# EAGLE design PCB with nRF SINGLE (EAGLE 6.2)
AUTHOR: K. Townsend
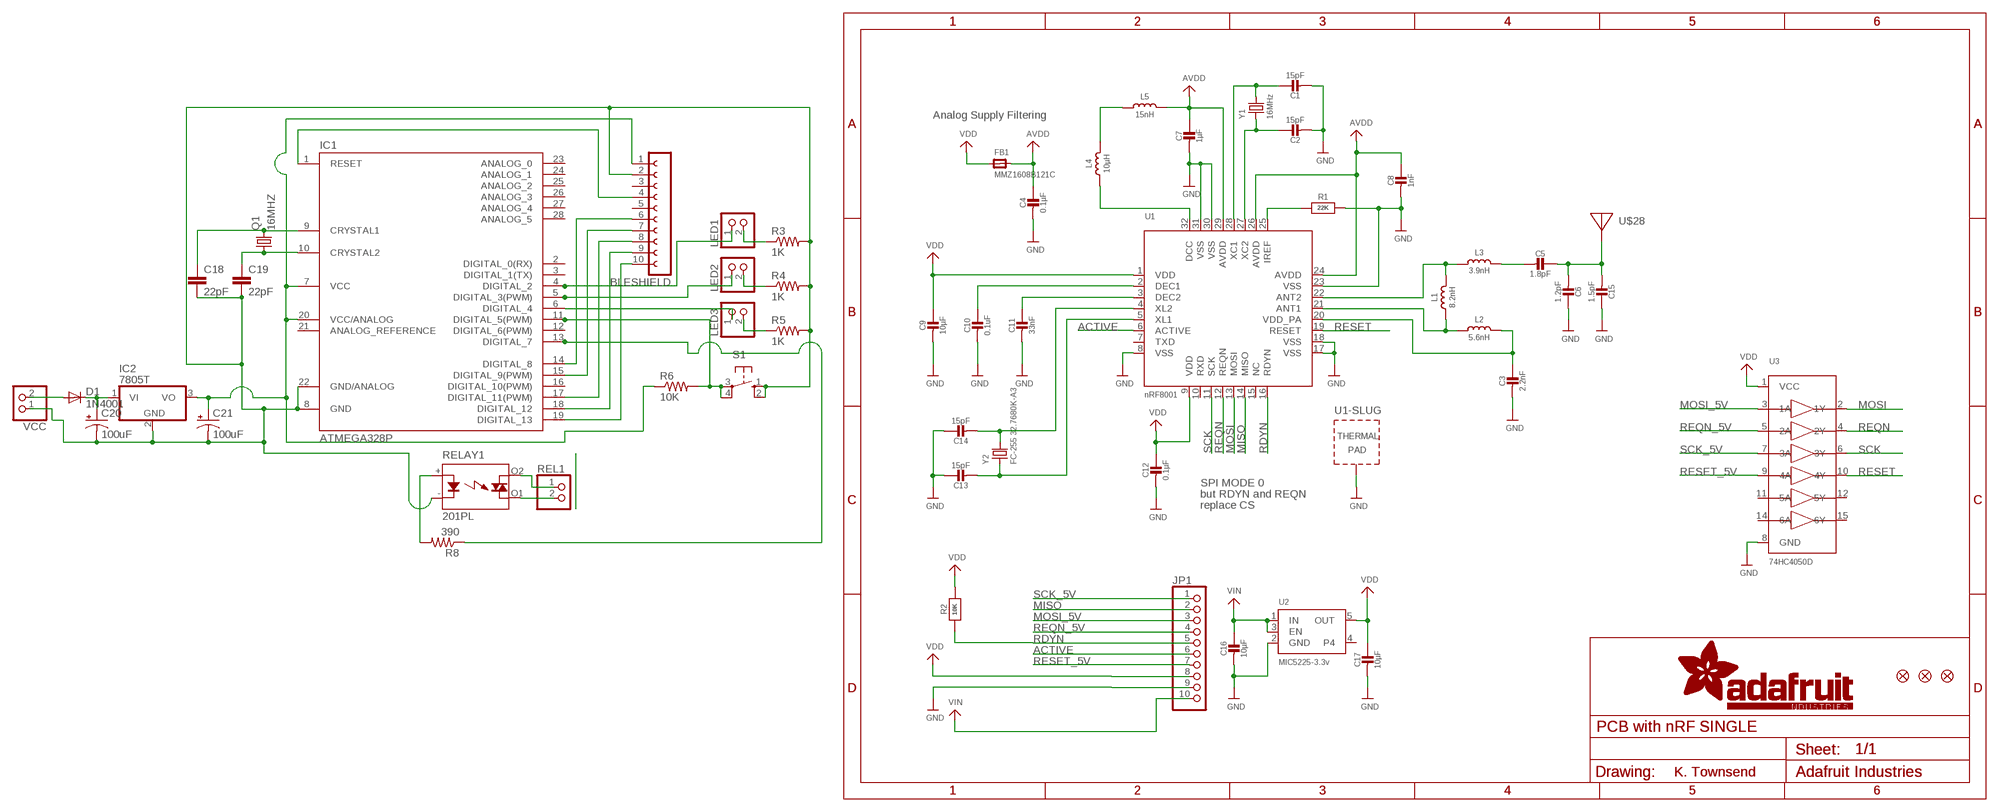
[diagram p0: schematic, sheet 1]

## Parts
BLESHIELD  FE10-1  [FE10]
C1  15pF  CAP_CERAMIC0805-NOOUTLINE  [0805-NO]
C2  15pF  CAP_CERAMIC0805-NOOUTLINE  [0805-NO]
C3  2.2nF  CAP_CERAMIC_0402  [_0402]
C4  0.1µF  CAP_CERAMIC0805-NOOUTLINE  [0805-NO]
C5  1.8pF  CAP_CERAMIC_0402MP  [_0402MP]
C6  1.2pF  CAP_CERAMIC_0402MP  [_0402MP]
C7  1µF  CAP_CERAMIC0805-NOOUTLINE  [0805-NO]
C8  1nF  CAP_CERAMIC_0603  [_0603]
C9  10µF  CAP_CERAMIC0805-NOOUTLINE  [0805-NO]
C10  0.1uF  CAP_CERAMIC0805-NOOUTLINE  [0805-NO]
C11  33nF  CAP_CERAMIC0805-NOOUTLINE  [0805-NO]
C12  0.1µF  CAP_CERAMIC0805-NOOUTLINE  [0805-NO]
C13  15pF  CAP_CERAMIC0805-NOOUTLINE  [0805-NO]
C14  15pF  CAP_CERAMIC0805-NOOUTLINE  [0805-NO]
C15  1.5pF  CAP_CERAMIC_0402MP  [_0402MP]
C16  10µF  CAP_CERAMIC0805-NOOUTLINE  [0805-NO]
C17  10µF  CAP_CERAMIC0805-NOOUTLINE  [0805-NO]
C18  22pF  C-EU025-030X050  [C025-030X050]
C19  22pF  C-EU025-030X050  [C025-030X050]
C20  100uF  CPOL-USE2.5-6  [E2,5-6]
C21  100uF  CPOL-USE2.5-6  [E2,5-6]
D1  1N4001  1N4004  [DO41-10]
FB1  MMZ1608B121C  FERRITE0805  [0805]
FID1  FIDUCIAL""  [FIDUCIAL_1MM]
FID2  FIDUCIAL""  [FIDUCIAL_1MM]
FID3  FIDUCIAL""  [FIDUCIAL_1MM]
IC1  ATMEGA328P  ATMEGA168-PU  [DIL28-3]
IC2  7805T  [TO220H]
JP1  HEADER-1X1070MIL  [1X10_ROUND70]
L1  8.2nH  INDUCTOR_0402  [_0402]
L2  5.6nH  INDUCTOR_0402  [_0402]
L3  3.9nH  INDUCTOR_0402  [_0402]
L4  10µH  INDUCTOR_0603  [_0603]
L5  15nH  INDUCTOR_0603  [_0603]
LED1  PINHD-1X2  [1X02]
LED2  PINHD-1X2  [1X02]
LED3  PINHD-1X2  [1X02]
Q1  16MHZ  CRYSTALHC49S  [HC49/S]
R1  22K  RESISTOR_0805MP  [_0805MP]
R2  10K  RESISTOR0805_NOOUTLINE  [0805-NO]
R3  1K  R-US_0204/5  [0204/5]
R4  1K  R-US_0204/5  [0204/5]
R5  1K  R-US_0204/5  [0204/5]
R6  10K  R-US_0204/5  [0204/5]
R8  390  R-US_0204/5  [0204/5]
REL1  PINHD-1X2  [1X02]
RELAY1  201PL  AQG12105  [AQG]
S1  10-XX  [B3F-10XX]
U1  nRF8001  NRF8001  [QFN32_5MM]
U2  MIC5225-3.3v  VREG_SOT23-5  [SOT23-5]
U3  74HC4050D  74HC4050DTSSOP  [TSSOP16]
U$28  ANTENNA_PCBNRF8001_1.6MM  [ANT_PCB_2.4GHZ_NRF8001_1.6MM_1OZ]
VCC  PINHD-1X2  [1X02]
Y1  16MHz  CRYSTAL2.5X2.0  [CRYSTAL_2.5X2]
Y2  FC-255 32.7680K-A3  CRYSTAL4.9X1.8  [CRYSTAL_4.9X1.8]

## Nets
ACTIVE: JP1.6 U1.6(ACTIVE)
AVDD: C4.1 C7.1 C8.1 FB1.2 L5.2 U1.24(AVDD) U1.26(AVDD) U1.29(AVDD)
GND: C1.2 C2.2 C3.2 C4.2 C6.1 C7.2 C8.2 C9.2 C10.2 C11.2 C12.2 C13.1 C14.1 C15.1 C16.2 C17.2 JP1.9 R1.2 U1.8(VSS) U1.17(VSS) U1.18(VSS) U1.23(VSS) U1.30(VSS) U1.31(VSS) U1.33(TP) U2.2(GND) U3.8(GND)
MISO: JP1.2 U1.14(MISO)
MOSI: U1.13(MOSI) U3.2(1Y)
MOSI_5V: JP1.3 U3.3(1A)
N$1: BLESHIELD.10 IC1.19(DIGITAL_13)
N$2: L1.2 L3.1 U1.22(ANT2)
N$3: L1.1 L2.1 U1.21(ANT1)
N$4: C3.1 L2.2 U1.20(VDD_PA)
N$5: L4.2 L5.1
N$6: C5.2 L3.2
N$7: C11.1 U1.3(DEC2)
N$8: C10.1 U1.2(DEC1)
N$9: C1.1 U1.28(XC1) Y1.3
N$10: C2.1 U1.27(XC2) Y1.1
N$11: L4.1 U1.32(DCC)
N$12: R1.1 U1.25(IREF)
N$13: C5.1 C6.2 C15.2 U$28.FEED
N$14: C18.1 IC1.9(CRYSTAL1) Q1.2
N$15: C19.1 IC1.10(CRYSTAL2) Q1.1
N$16: BLESHIELD.6 IC1.14(DIGITAL_8)
N$17: BLESHIELD.7 IC1.15(DIGITAL_9(PWM))
N$18: BLESHIELD.8 IC1.17(DIGITAL_11(PWM))
N$19: BLESHIELD.9 IC1.18(DIGITAL_12)
N$20: BLESHIELD.1 C21.+ IC1.7(VCC) IC1.20(VCC/ANALOG) IC2.3(VO) R6.1
N$21: BLESHIELD.4 IC1.1(RESET)
N$22: C14.2 U1.4(XL2) Y2.2
N$23: C13.2 U1.5(XL1) Y2.1
N$24: IC1.4(DIGITAL_2) LED1.1
N$25: IC1.5(DIGITAL_3(PWM)) LED2.1
N$26: LED1.2 R3.1
N$27: LED2.2 R4.1
N$28: LED3.2 R5.1
N$29: IC1.11(DIGITAL_5(PWM)) R6.2 S1.3(P) S1.4(P1)
N$32: REL1.2 RELAY1.O1(DS2)
N$33: IC1.13(DIGITAL_7) R8.1
N$34: C20.+ D1.C IC2.1(VI)
N$35: BLESHIELD.2 C18.2 C19.2 C20.- C21.- IC1.8(GND) IC1.22(GND/ANALOG) IC2.2(GND) R3.2 R4.2 R5.2 RELAY1.-(K) S1.1(S) S1.2(S1) VCC.1
N$36: D1.A VCC.2
N$37: IC1.6(DIGITAL_4) LED3.1
N$38: R8.2 RELAY1.+(A)
RDYN: JP1.5 R2.1 U1.16(RDYN)
REL1: REL1.1 RELAY1.O2(DS1)
REQN: U1.12(REQN) U3.4(2Y)
REQN_5V: JP1.4 U3.5(2A)
RESET: U1.19(RESET) U3.10(4Y)
RESET_5V: JP1.7 U3.9(4A)
SCK: U1.11(SCK) U3.6(3Y)
SCK_5V: JP1.1 U3.7(3A)
VDD: C9.1 C12.1 C17.1 FB1.1 JP1.8 R2.2 U1.1(VDD) U1.9(VDD) U2.5(OUT) U3.1(VCC)
VIN: C16.1 JP1.10 U2.1(IN) U2.3(EN)
Unconnected: BLESHIELD.3 BLESHIELD.5 IC1.2(DIGITAL_0(RX)) IC1.3(DIGITAL_1(TX)) IC1.12(DIGITAL_6(PWM)) IC1.16(DIGITAL_10(PWM)) IC1.21(ANALOG_REFERENCE) IC1.23(ANALOG_0) IC1.24(ANALOG_1) IC1.25(ANALOG_2) IC1.26(ANALOG_3) IC1.27(ANALOG_4) IC1.28(ANALOG_5) U1.7(TXD) U1.10(RXD) U1.15(NC) U2.4 U3.11(5A) U3.12(5Y) U3.14(6A) U3.15(6Y)

## Notes on the sheet
- Analog Supply Filtering
- SPI MODE 0
- but RDYN and REQN
- replace CS

## Library data of the parts
BLESHIELD = con-lsta:FE10-1: FEMALE HEADER; OC_FARNELL: unknown; OC_NEWARK: unknown
C1-C17 = microbuilder:CAP_CERAMIC: Ceramic Capacitors For new designs, use the packages preceded by an '_' character since they are more reliable: The following footprints should be used on most boards: _0402 - Standard footprint for regular board layouts _0603 - Standard footprint for regular board layouts _0805 - Standard footprint for regular board layouts _1206 - Standard footprint for regular board layouts For extremely tight-pitch boards where space is at a premium, the following 'micro-pitch' footprints can be used (smaller pads, no silkscreen outline, etc.): _0402MP - Micro-pitch footprint for very dense/compact boards _0603MP - Micro-pitch footprint for very dense/compact boards _0805MP - Micro-pitch footprint for very dense/compact boards _1206MP - Micro-pitch footprint for very dense/compact boards
C18 C19 = rcl:C-EU: CAPACITOR, European symbol
C20 C21 = rcl:CPOL-US: POLARIZED CAPACITOR, American symbol
D1 = diode:1N4004: DIODE general purpose rectifier, 1 A
FB1 = microbuilder:FERRITE: Ferrite Bead 0603 MMZ1608B121C - 120 Ohm @ 100MHz, 600mA, 0.15 Ohm DC Resistance - Digikey: 445-2164-1-ND BK1608HW121-T - 120 Ohm, 600mA Ferrite Chip - Digikey: 587-1876-2-ND 0805 HZ0805B272R-10 - 2.7K Ohm @ 100MHz, 200mA, 0.8 Ohm DC Resistance - Digikey: 240-2504-1-ND (see also Murata BLM21BD272SN1L) MMZ2012Y152B - 1.5K Ohm @ 100MHz, 500mA, 0.4 Ohm DC Resistance - Digikey: 445-1560-1-ND - Mainly for high frequency (80-400MHz) MMZ2012R102A - 1K Ohm @ 100MHz, 500mA, 0.3 Ohm DC Resistance - Digikey: 445-1555-2-ND - More general purpose (10-200MHz)
FID1-FID3 = microbuilder:FIDUCIAL: Fiducial Alignment Points Various fiducial points for machine vision alignment.; BOM: EXCLUDE
IC1 = Arduino-AVR:ATMEGA168-PU
IC2 = linear:78*: Positive VOLTAGE REGULATOR Source: http://cache.national.com/ds/LM/LM78L05.pdf http://www.fairchildsemi.com/ds/LM/LM7805.pdf
JP1 = microbuilder:HEADER-1X10: PIN HEADER
L1-L5 = microbuilder:INDUCTOR: Inductors 0603: 10nH Ceramic Inductor - microwire antenna/RF (Digikey: 712-1434-2-ND) 0805: 560nH Ceramic Inductor - RF (Digikey: 553-1047-1-ND) 270nH Ceramic Inductor - Q = 40@250MHz, +-5%, 1 Ohm DC Resistance (Digikey: 535-10506-2-ND) 1007 (2518 Metric) SMT: 10µH 10% 250mOhm 820mA 1007 Inductor (Digikey: 587-2189-1-ND) 22µH 10% 500mOhm 580mA 1007 Inductor (Digikey: 587-2190-1-ND) 47µH 10% 950mOhm 420mA 1007 Inductor (Digikey: 587-2191-1-ND) 47µH 5% 100mOhm 1A 1008 Inductor (Digikey: 732-1816-1-ND) 5.0x5.0mm (Taiyo Yuden NR5040 Series) 6.8µH 20% 2.3A 64mOhm Inductor (Digikey: 587-2374-2-ND) 5.0x5.0mm (TDK VLC5045 Series) 4.7µH 20% 3.3A 34mOhm Inductor (Digikey: 445-6526-1-ND) 6.8µH 20% 2.7A 46mOhm Inductor (Digikey: 445-6527-1-ND) 6.0x6.0mm (TDK VLC6045 Series) 4.7µH 20% 3.8A 27mOhm Inductor (Digikey: 445-6538-2-ND) 6.8µH 20% 3A 41mOhm Inductor (Digikey: 445-6540-1-ND) 6.2µH 30% 2.2A 45mOhm Inductor (Digikey: SRR5028-6R2YCT-ND) - Not TDK VLC6045 but footprint should match 6.0x6.0mm (TDK SLF6045 Series) 6.8uH 30% 2A 33mOhm Inductor (Digikey: 445-4572-1-ND, Mouser: 810-SLF645T6R8N2R0PF) 6.0x6.0mm (Sumida CDRH5D28 Series) 6.2uH 30% 1.8A 45mOhm Inductor (Digikey: 308-1542-1-ND) Taiyo Yuden NR3015T2R2M - 2.2uH 20% 1.5A (Digikey: 587-1648-2-ND, Mouser: 963-NR3015T2R2M) - Used with TI TPS62172 CoilCraft RFID Transponder Coil - MA5532-AE (For use with AS3935 Lightning Sensor)
LED1-LED3 REL1 VCC = pinhead:PINHD-1X2: PIN HEADER
Q1 = crystal:CRYSTAL: CRYSTAL; OC_FARNELL: 1667008; OC_NEWARK: unknown
R1 R2 = microbuilder:RESISTOR: Resistors For new designs, use the packages preceded by an '_' character since they are more reliable: The following footprints should be used on most boards: _0402 - Standard footprint for regular board layouts _0603 - Standard footprint for regular board layouts _0805 - Standard footprint for regular board layouts _1206 - Standard footprint for regular board layouts For extremely tight-pitch boards where space is at a premium, the following 'micro-pitch' footprints can be used (smaller pads, no silkscreen outline, etc.): _0402MP - Micro-pitch footprint for very dense/compact boards _0603MP - Micro-pitch footprint for very dense/compact boards _0805MP - Micro-pitch footprint for very dense/compact boards _1206MP - Micro-pitch footprint for very dense/compact boards
R3-R6 R8 = resistor:R-US_: RESISTOR, American symbol
RELAY1 = relay:AQG*: SOLID STATE RELAY NAiS Zero-cross, Non zero-cross Source: http://www.mew-europe.com/.. en_ds_61611_0000.pdf; MF: AROMAT/ MATSUSHITA; MPN: AQG12105; OC_FARNELL: unknown; OC_NEWARK: 20J4759
S1 = switch-omron:10-XX: OMRON SWITCH; MPN: B3F-1000; OC_FARNELL: 176432; OC_NEWARK: 36M3542
U1 = microbuilder:NRF8001: nRF8001 - Bluetooth Low-Energy Transceiver VDD: 1.9-3.6V Temp: -40°C - 85°C
U2 = microbuilder:VREG_SOT23-5: SOT23-5 Fixed Voltage Regulators Part Current Out V Out V In V Dropout θJA (°C/W) TJ (°C) Digikey Part No. ADP121 150mA 3.3V 3.4-5.5V 0.09V @ 150mA -- -- ADP121-AUJZ33R7CT-ND ADP121 150mA 3.0V 3.1-5.5V 0.09V @ 150mA -- -- ADP121-AUJZ30R7CT-ND ADP122 300mA 3.3V 3.4-5.5V 0.085V @ 300mA -- -- ADP122AUJZ-3.3-R7CT-ND ADP1712 300mA 3.3V 3.5-5.5V 0.17V @ 300mA -- -- ADP1712AUJZ-3.3-R7TR-ND AP7311 (Low Cost) 150mA 3.3V 3.5-6V 0.15V @ 150mA -- -- AP7311-33WG-7DICT-ND LD39015M18R 150mA 1.8V 1.9V-5.5V 0.08V @ 100mA -- -- 497-6977-1-ND LP2985A-33DBVR 150mA 3.3V 3.3-16V 0.28V @ 150mA 206 150 296-18479-1-ND MCP1824T-3302E/OT 300mA 3.3V 3.5V-6V 0.2V @ 300mA -- -- MCP1824T-3302E/OTCT-ND MIC5205-2.5YM5 TR 150mA 2.5V 2.7-16V 0.165V @ 150mA -- -- 576-1257-2-ND MIC5205-3.0YM5 TR 150mA 3.0V 3.2V-16V 0.165V @ 150mA -- -- 576-1258-2-ND MIC5205-3.3YM5 TR 150mA 3.3V 3.5V-16V 0.165V @ 150mA -- -- 576-1259-2-ND TPS780330220 150mA 3.3V+2.2V 3.6-5.5V 250mV Max -- -- 296-23332-1-ND TDA3663/N1,135 100mA 3.3V 3.5-45V 0.18V @ 50mA -- -- 568-5343-1-ND Max operating temp can be calculated using θJA, TJ (max junction temperature), and power in watts. Set the "Maximum Ambient Temperature" until it reaches TJ ("Max Junction Temperature"), which is the absolute limit for safe use of the regulator: Heat Sink Temperature Calculator <http://www.daycounter.com/Calculators/Heat-Sink-Temperature-Calculator.phtml> For example, With 12V source into a 3.3V LP2985 and a 30mA load, we are dissipating (12V-3.3V) * 0.03A = 0.261W. With a θJA of 206 °C/W, a TJ of 150°C, and 261mW we can safely use the chip without a heat sink up to 75°C (=147.1°C Junction Temperature).
U3 = microbuilder:74HC4050D: 6-channel level shifter 74HC4050D - 2V-6V Supply SOIC16 Digikey: 74HC4050D,653-ND Mouser: 771-74HC4050D-T TSSOP16 Digikey: 296-9215-1-ND Mouser:
U$28 = microbuilder:ANTENNA_PCB: Various pre-calculated PCB Antennas NRF8001 1.6mm 1Oz - 2.4GHz PCB antenna for 1.6mm PCBs with 1oz copper, double-sided boards (no GND plan beneath antenna). See nRF2740 production files for further information and impedance matching network. 868MHz/2.4GHz DUALBAND - Dual 868MHz and 2.4GHz centered antenna based on board #6 of the CC-ANTENNA-DK from Chipcon/TI
Y1 Y2 = microbuilder:CRYSTAL: Crystals HC49UP - Surface Mount Crystal 4.0MHz 18pF +/-30ppm Surface Mount Crystal [Digikey: 535-9857-1-ND] 12.0 MHz Surface Mount Crystal [Digikey: 535-9869-6-ND] 25.0 MHz Surface Mount Crystal [Digikey: 535-9078-1-ND] 2.5 x 2.0mm - MEMs SMT Crystal 16.0 MHz 10pF 20ppm 2.5 x 2.0mm Crystal [Digikey -40-85°C: 535-10923-1-ND] 3.2 x 2.5mm - MEMs SMT Crystal 12.0 MHz 8pF 15ppm 3.2 x 2.5mm Crystal [Digikey: -10-70°C: 644-1047-1-ND -40-125°C: 644-1128-1-ND] 40~85°C cheaper: 644-1173-6-ND 16.0 MHz 8pF 15ppm 3.2 x 2.5mm Crystal [Digikey: -10-70°C: 644-1049-1-ND -40-125°C: 644-1129-2-ND]-40~85°C cheaper: 644-1175-6-ND 16.0 MHz 10pF 10ppm 3.2 x 2.5mm Crystal [Digikey: 644-1100-1-ND] 27.12 MHz 18pF 30ppm 3.2 x 2.5mm Crystal [Digikey: 887-1424-1-ND] 27.12MHz 10pF 10ppm 3.2 x 2.5mm Crystal [Digikey: 887-1329-1-ND] 4.9 x 1.8mm - MEMs SMT Crystal 32.768 KHz 12.5pF 20ppm 4.9 x 1.8mm Crystal [Digikey: SE2415CT-ND] 8.0 x 3.8mm - Surface Mount Crystal 32.768kHz 12.5pF 20ppm -40°C-85°C [Digikey: 535-9166-2-ND] Cylinder 32.768KHz Cylinder Crystal (2x6mm body) [Ex. Digikey: 300-8341-2-ND]

## Board
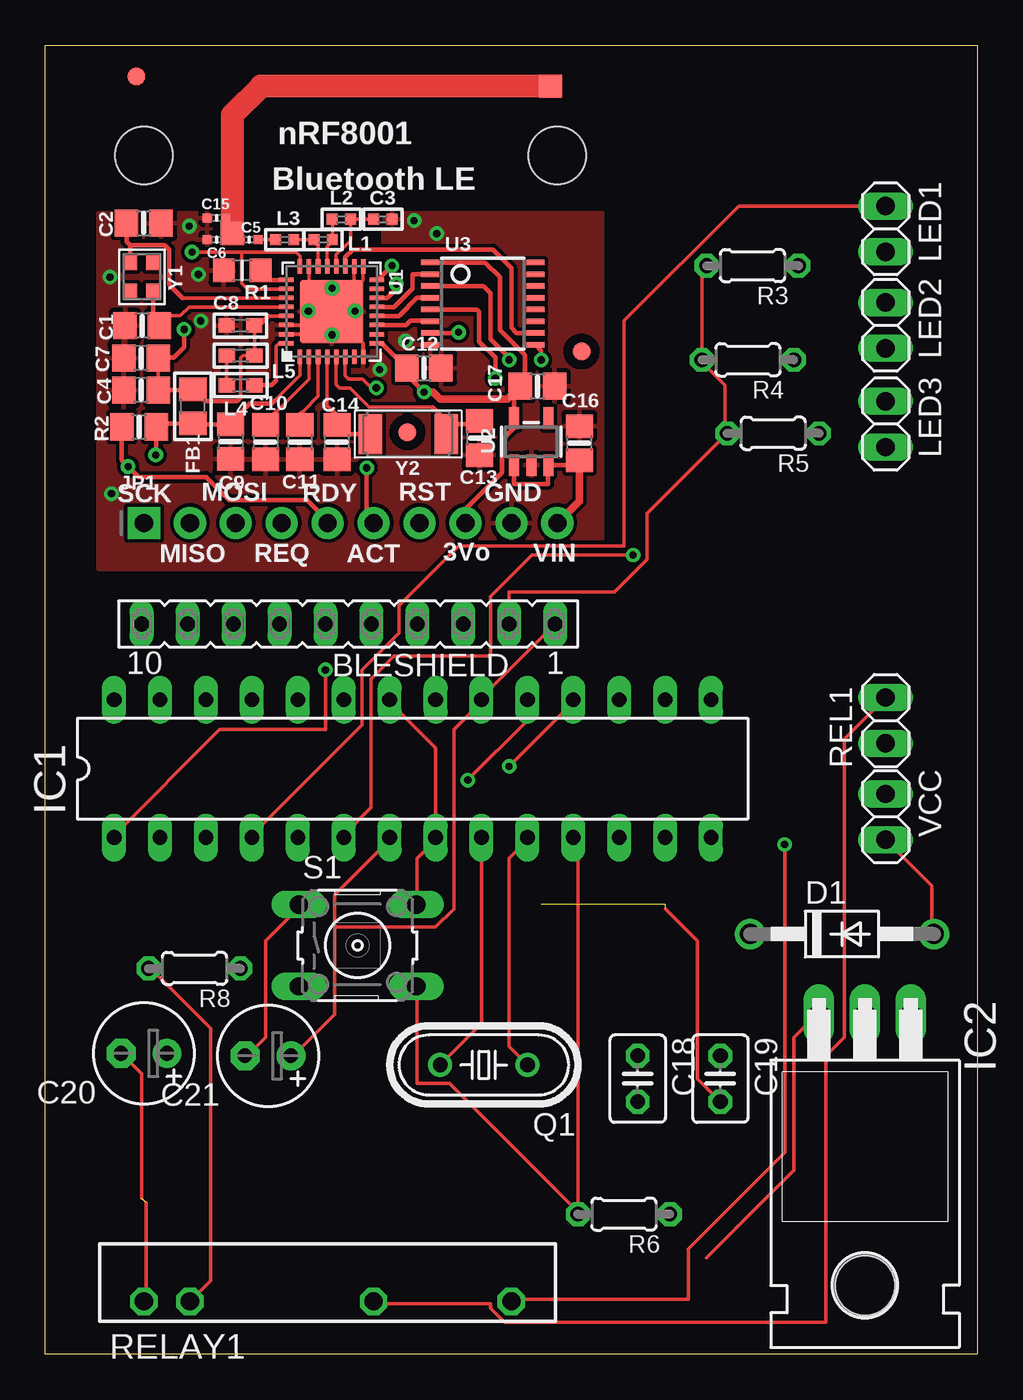
[diagram p1: board, top side]
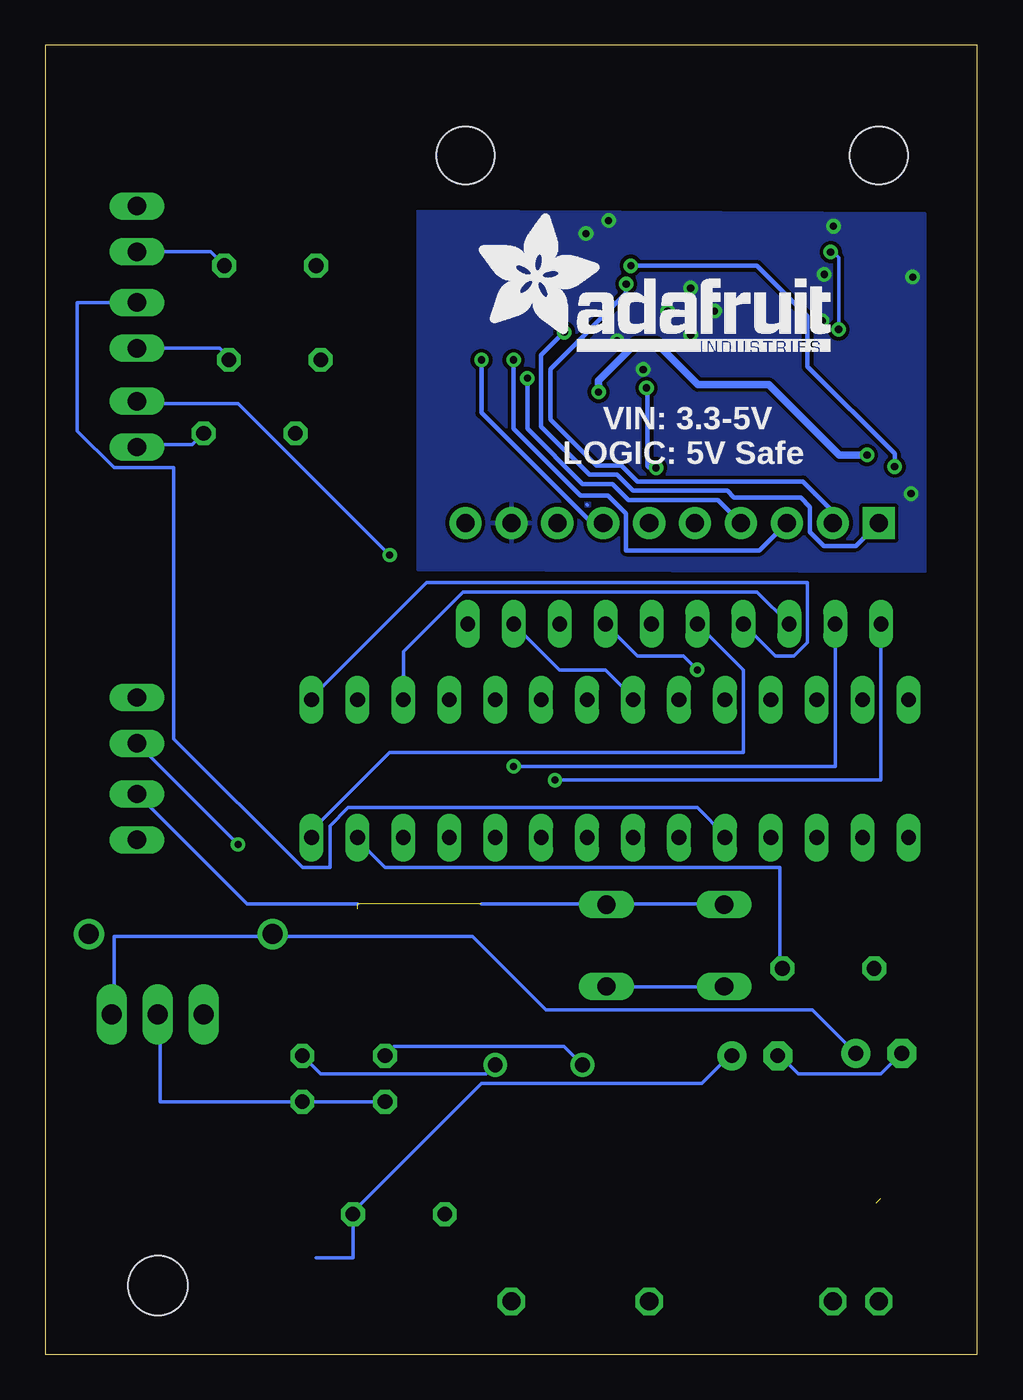
[diagram p2: board, bottom side, seen from below]

Size 51.56 x 72.39 mm. Coordinates in mm from the lower left corner, seen from the top.
Outline: 0,0 0,72.39 51.56,72.39 51.56,0 0,0
Copper layers (1*16): Top 0.035mm / dielectric 1.5mm / Bottom 0.035mm
Design rules: minimum track width 8mil, minimum drill 15.5mil, track to track 8mil, track to pad 8mil, pad to pad 8mil, via to via 8mil, smd to smd 8mil, copper to edge 10mil, drill to drill 8mil, minimum pad ring 10mil, minimum via ring 8mil, stop-mask expansion 4mil, vias tented up to drill 20mil, thermal gap 10mil
Holes 3.2 mm at 5.46,66.29 28.32,66.29
tRestrict: area 13.2,56.6 to 13.5,56.7

### Footprints (pad centres in the part's own frame; a part is rotated, then mirrored left to right if it is on the bottom)
FE10 = drill 0.813 long: 1 -11.43,0; 2 -8.89,0; 3 -6.35,0; 4 -3.81,0; 5 -1.27,0; 6 1.27,0; 7 3.81,0; 8 6.35,0; 9 8.89,0; 10 11.43,0
0805-NO = smd 1.3 x 1.5: 1 -0.95,0; 2 0.95,0
_0402 = smd 0.6 x 0.6: 1 -0.508,0; 2 0.508,0
_0402MP = smd 0.5 x 0.5: 1 -0.508,0; 2 0.508,0
_0603 = smd 0.9 x 0.8: 1 -0.762,0; 2 0.762,0
C025-030X050 = drill 0.813 octagon: 1 -1.27,0; 2 1.27,0
E2,5-6 = drill 0.813 pad 1.6: + -1.27,0 | drill 0.813 pad 1.6 octagon: - 1.27,0
DO41-10 = drill 1.118: A 5.08,0; C -5.08,0
0805 = smd 1.3 x 1.5: 1 -0.95,0; 2 0.95,0
FIDUCIAL_1MM = smd 1 x 1: 1 0,0
DIL28-3 = drill 0.813 long: 1 -16.51,-3.81; 2 -13.97,-3.81; 3 -11.43,-3.81; 4 -8.89,-3.81; 5 -6.35,-3.81; 6 -3.81,-3.81; 7 -1.27,-3.81; 8 1.27,-3.81; 9 3.81,-3.81; 10 6.35,-3.81; 11 8.89,-3.81; 12 11.43,-3.81; 13 13.97,-3.81; 14 16.51,-3.81; 15 16.51,3.81; 16 13.97,3.81; 17 11.43,3.81; 18 8.89,3.81; 19 6.35,3.81; 20 3.81,3.81; 21 1.27,3.81; 22 -1.27,3.81; 23 -3.81,3.81; 24 -6.35,3.81; 25 -8.89,3.81; 26 -11.43,3.81; 27 -13.97,3.81; 28 -16.51,3.81
TO220H = drill 1.118 long: 1 -2.54,-10.16; 2 0,-10.16; 3 2.54,-10.16 | hole 3.302: 0,4.826
1X10_ROUND70 = drill 1 pad 1.778 square: 1 -11.43,0 | drill 1 pad 1.778: 2 -8.89,0; 3 -6.35,0; 4 -3.81,0; 5 -1.27,0; 6 1.27,0; 7 3.81,0; 8 6.35,0; 9 8.89,0; 10 11.43,0
1X02 = drill 1.016 long: 1 -1.27,0; 2 1.27,0
HC49/S = drill 0.813: 1 -2.413,0; 2 2.413,0
_0805MP = smd 1.2 x 1.3: 1 -1.016,0; 2 1.016,0
0204/5 = drill 0.813 octagon: 1 -2.54,0; 2 2.54,0
AQG = drill 1 octagon: + -7.62,0; - -10.16,0; O1 2.54,0; O2 10.16,0
B3F-10XX = drill 1.016 long: 1 -3.251,2.261; 2 3.251,2.261; 3 -3.251,-2.261; 4 3.251,-2.261
QFN32_5MM = smd 0.8 x 0.25: 1 -2.5,1.75; 2 -2.5,1.25; 3 -2.5,0.75; 4 -2.5,0.25; 5 -2.5,-0.25; 6 -2.5,-0.75; 7 -2.5,-1.25; 8 -2.5,-1.75; 17 2.5,-1.75; 18 2.5,-1.25; 19 2.5,-0.75; 20 2.5,-0.25; 21 2.5,0.25; 22 2.5,0.75; 23 2.5,1.25; 24 2.5,1.75 | smd 0.25 x 0.8: 9 -1.75,-2.5; 10 -1.25,-2.5; 11 -0.75,-2.5; 12 -0.25,-2.5; 13 0.25,-2.5; 14 0.75,-2.5; 15 1.25,-2.5; 16 1.75,-2.5; 25 1.75,2.5; 26 1.25,2.5; 27 0.75,2.5; 28 0.25,2.5; 29 -0.25,2.5; 30 -0.75,2.5; 31 -1.25,2.5; 32 -1.75,2.5 | smd 3.5 x 3.5: 33 0,0
SOT23-5 = smd 0.55 x 1.2: 1 -0.95,-1.3; 2 0,-1.3; 3 0.95,-1.3; 4 0.95,1.3; 5 -0.95,1.3
TSSOP16 = smd 0.305 x 0.991: 1 -2.275,-2.918; 2 -1.625,-2.918; 3 -0.975,-2.918; 4 -0.325,-2.918; 5 0.325,-2.918; 6 0.975,-2.918; 7 1.625,-2.918; 8 2.275,-2.918; 9 2.275,2.918; 10 1.625,2.918; 11 0.975,2.918; 12 0.325,2.918; 13 -0.325,2.918; 14 -0.975,2.918; 15 -1.625,2.918; 16 -2.275,2.918
ANT_PCB_2.4GHZ_NRF8001_1.6MM_1OZ = smd 1.27 x 1.27: FEED 0,0; TESTPOINT -8.169,17.605
CRYSTAL_2.5X2 = smd 0.9 x 0.75: 1 -0.825,-0.625; 2 0.825,-0.625; 3 0.825,0.625; 4 -0.825,0.625
CRYSTAL_4.9X1.8 = smd 1.3 x 2.2: 1 -2.1,0; 2 2.1,0

### Placement (x,y rotation side)
BLESHIELD  16.76,40.39 180 top
C1  5.37,56.87 180 top
C2  5.45,62.56 0 top
C3  18.67,62.76 0 top
C4  5.3,53.32 180 top
C5  11.27,61.64 0 top
C6  9.47,61.64 0 top
C7  5.3,55.09 180 top
C8  10.8,56.89 180 top
C9  10.25,50.46 270 top
C10  12.18,50.43 270 top
C11  14.08,50.43 270 top
C12  20.94,54.53 0 top
C13  24.03,50.67 90 top
C14  16.13,50.44 90 top
C15  9.47,62.84 0 top
C16  29.54,50.38 90 top
C17  27.22,53.53 0 top
C18  32.77,15.24 270 top
C19  37.34,15.24 270 top
C20  5.46,16.64 180 top
C21  12.32,16.51 180 top
D1  44.07,23.24 0 top
FB1  8.17,52.42 90 top
FID1  20.03,50.99 270 top
FID2  29.66,55.45 270 top
FID3  5.05,70.67 270 top
IC1  20.32,32.38 0 top
IC2  45.34,8.64 180 top
JP1  16.89,45.97 0 top
L1  15.37,61.64 180 top
L2  16.37,62.76 0 top
L3  13.25,61.64 180 top
L4  10.81,53.58 180 top
L5  10.81,55.23 0 top
LED1  46.48,62.23 270 top
LED2  46.48,56.9 270 top
LED3  46.48,51.44 270 top
Q1  24.26,16 180 top
R1  10.9,59.93 180 top
R2  5.19,51.29 0 top
R3  39.12,60.2 180 top
R4  38.86,54.99 180 top
R5  40.26,50.93 180 top
R6  32,7.75 180 top
R8  8.26,21.34 180 top
REL1  46.48,35.05 90 top
RELAY1  15.62,2.92 0 top
S1  17.27,22.61 0 top
U1  15.84,57.66 90 top
U2  26.89,50.47 0 top
U3  24.19,58.1 270 top
U$22  [ADAFRUIT_TEXT_20MM]  27.72,55.45 0 bottom
U$28  10.35,61.96 270 top
VCC  46.48,29.72 270 top
Y1  5.35,59.59 270 top
Y2  20.07,50.88 180 top

### Tracks (layer width: path | path; a pad name or v marks a point on that pad's centre or on a via)
ACTIVE  (via drill 0.39, 0.4)
  Top 0.203: U1.6 16.59,54.12 16.77,53.94 17.55,53.94 18.05,53.44 v18.31,53.44
  Top 0.254: JP1.6 17.78,46.35 v17.78,49.02
  Bottom 0.203: v18.31,53.44 18.26,53.44
  Bottom 0.254: 18.26,53.44 18.26,49.12 18.16,49.02 v17.78,49.02
AVDD  (via drill 0.4)
  Top 0.203: U1.24 14.09,60.72 13.87,60.94 10.87,60.94 | 10.87,60.94 8.14,60.94 v8.12,60.95 | U1.26 11.2,58.91 10.87,59.24 10.87,60.94 | U1.29 12.34,57.41 | C7.1 C4.1 | C8.1 11.57,56.88 L5.2 10.92,55.23 10.8,55.11 10.8,52.9
  Top 0.254: C4.1 8.17,53.31 FB1.2 8.84,52.7 10.61,52.7 10.8,52.9 | 12.34,57.41 11.81,56.89 C8.1 | v7.68,56.67 7.68,55.69 7.11,55.12 6.29,55.12 C7.1
  Bottom 0.203: v7.68,56.67 7.68,60.64 7.98,60.94 8.11,60.94 v8.12,60.95
GND  (via drill 0.4)
  Top 0.203: U1.33 15.09,56.91 14.47,56.91 | U1.8 17.59,55.91 U1.33 | U1.17 17.59,59.41 U1.33 | U1.23 14.59,59.22 14.67,59.14 15.69,59.14 v15.87,58.96 | U1.18 17.09,57.73 v17.14,57.69 | U1.30 14.47,56.91 | U1.31 14.4,56.41 14.47,56.34 14.47,56.91
  other vias: 15.87,56.37 14.55,57.69 18.5,54.45 21.66,61.97 20.41,62.69 8.6,57.14 8.47,59.71 19.93,56.04 3.67,47.59 3.59,59.57 7.97,62.38
  pour Bottom: 2.92,63.07 30.94,63.2 30.94,43.41 2.92,43.28
  pour Top: 18.67,59.14 18.67,63.14 30.81,63.14 30.81,43.41 2.92,43.41 2.92,63.14 9.17,63.14 9.17,60.64 13.17,60.64 13.17,59.14
MISO  (via drill 0.39)
  Top 0.254: U1.14 18.91,58.41 19.43,58.93 v19.43,59.18
  Bottom 0.254: JP1.2 8,46.61 9.65,48.26 18.8,48.26 19.68,49.15 21.08,49.15 23.62,51.69 23.62,54.48 19.43,58.67 v19.43,59.18
MOSI
  Top 0.254: U3.2 20.36,59.73 20.32,59.69 20.32,58.93 19.3,57.91 U1.13
MOSI_5V  (via drill 0.39)
  Top 0.254: U3.3 24.23,59.08 24.64,58.67 24.64,56.13 25.65,55.12 v25.65,54.99
  Bottom 0.254: v25.65,54.99 25.65,51.18 21.97,47.5 20.45,47.5 19.43,46.48 19.43,44.45 12.06,44.45 JP1.3
N$1  (via drill 0.39)
  Top 0.203: v23.37,31.75 26.67,35.05 IC1.19
  Bottom 0.203: BLESHIELD.10 5.33,31.75 v23.37,31.75
N$2
  Top 0.203: U1.22 15.09,61.31 14.87,61.54 L1.2 L3.1
N$3
  Top 0.203: U1.21 15.59,61.25 15.88,61.54 L1.1 15.88,62.75 L2.1
N$4
  Top 0.203: U1.20 16.09,60.81 16.88,61.59 L2.2 C3.1
N$5
  Top 0.203: L4.2 L5.1
N$6
  Top 0.203: L3.2 C5.2
N$7
  Top 0.203: U1.3 15.09,52.98 14.22,52.11
  Top 0.254: 14.22,52.11 14.08,51.97 C11.1
N$8
  Top 0.203: U1.2 14.59,53.93 12.76,52.09
  Top 0.254: 12.76,52.09 12.18,51.52 C10.1
N$9
  Top 0.203: U1.28 7.95,57.91 7.47,57.44 6.57,57.44
  Top 0.254: Y1.3 5.97,57.22 C1.1 6.57,57.12 6.57,57.44
N$10
  Top 0.203: U1.27 7.6,58.41
  Top 0.254: 7.6,58.41 6.86,59.15 6.86,61.09 6.6,61.34 4.7,61.34 | 4.7,61.34 4.5,61.54 C2.1 | Y1.1 4.7,60.43 4.7,61.34
N$11
  Top 0.203: U1.32 12.95,55.91 12.77,55.74 12.77,53.84
  Top 0.254: 12.77,53.84 12.52,53.58 L4.1
N$12
  Top 0.254: U1.25 12.43,59.41 R1.1
N$13
  Top 0.203: C5.1 C6.2 9.98,61.59 U$28.FEED 9.98,62.33 C15.2
N$14
  Top 0.203: Q1.2 24.13,18.29 IC1.9
  Bottom 0.203: C18.1 32.26,17.02 22.86,17.02 Q1.2
N$15
  Top 0.203: Q1.1 25.65,17.02 25.65,27.43 26.67,28.45 IC1.10
  Bottom 0.203: Q1.1 27.18,15.49 36.32,15.49 C19.1
N$16
  Bottom 0.203: BLESHIELD.6 12.95,37.85 12.95,33.27 32.51,33.27 36.83,28.96 IC1.14
N$17
  Bottom 0.203: BLESHIELD.7 11.18,38.61 10.16,38.61 9.4,39.37 9.4,42.67 30.48,42.67 36.83,36.32 IC1.15
N$18
  Bottom 0.203: BLESHIELD.8 12.19,42.16 28.45,42.16 31.75,38.86 IC1.17
N$19  (via drill 0.39)
  Top 0.203: v25.65,32.51 29.21,36.07 IC1.18
  Bottom 0.203: BLESHIELD.9 7.87,32.51 v25.65,32.51
N$20  (1 unrouted)
  Top 0.203: 36.58,5.33 41.4,10.16 41.4,17.53 42.67,18.8 IC2.3 | BLESHIELD.1 24.13,36.32 IC1.20 24.13,36.07 22.61,34.54 22.61,24.64 21.59,23.62 16,23.62 | 16,23.62 16,18.8 13.72,16.51 C21.+ | 16,23.62 16,25.4 19.05,28.45 IC1.7
  Bottom 0.203: 36.58,5.33 34.54,5.33 R6.1 34.54,7.87 27.43,14.99 15.24,14.99 13.72,16.51 C21.+
N$21  (via drill 0.39)
  Top 0.203: v15.49,37.85 15.49,34.54 9.65,34.54 3.81,28.7 IC1.1
  Bottom 0.203: v15.49,37.85 16.26,38.61 18.8,38.61 BLESHIELD.4
N$22
  Top 0.203: U1.4 15.59,52.45 15.87,52.17
  Top 0.254: 15.87,52.17 16.13,51.91 C14.2 16.64,50.88 Y2.2
N$23
  Top 0.203: U1.5 16.09,53.62 16.27,53.44 16.87,53.44 17.92,52.38 21.43,52.38
  Top 0.254: 21.43,52.38 22.17,51.64 22.17,51.44 | 22.17,51.44 Y2.1 | C13.2 23.84,51.44 22.17,51.44
N$24
  Top 0.203: LED1.1 38.35,63.5 32,57.15 32,44.7 22.86,44.7 19.56,41.4 19.56,39.88 17.53,37.85 17.53,34.8 11.43,28.7 IC1.4
N$25
  Bottom 0.203: LED2.1 49.78,58.17 49.78,51.05 47.75,49.02 44.45,49.02 44.45,34.04 37.34,26.92 35.81,26.92 35.81,29.21 34.8,30.23 15.49,30.23 13.97,28.7 IC1.5
N$26
  Bottom 0.203: R3.1 42.42,60.96 LED1.2
N$27
  Bottom 0.203: LED2.2 41.91,55.63 41.4,55.12 R4.1
N$28
  Bottom 0.203: R5.1 43.43,50.29 46.48,50.29 LED3.2
N$29
  Top 0.203: 29.46,7.87 22.35,14.99 20.57,14.99 20.57,20.32 S1.4 | 29.46,7.87 29.46,28.19 29.21,28.45 IC1.11 | 29.46,7.87 R6.2
  Bottom 0.203: S1.3 14.22,20.32 20.32,20.32 S1.4
N$32
  Top 0.203: REL1.2 44.2,34.04 44.2,17.53 43.18,16.51 43.18,1.78 25.4,1.78 24.64,2.54 24.64,2.79 18.29,2.79 RELAY1.O1
N$33
  Bottom 0.203: R8.1 10.92,21.34 10.92,26.92 32.77,26.92 34.29,28.45 IC1.13
N$34
  Bottom 0.203: C20.+ 9.14,19.05 23.88,19.05 27.94,23.11 38.86,23.11 D1.C 39.12,23.11 47.75,23.11 47.75,18.8 IC2.1
N$35  (3 unrouted)
  Top 0.203: C19.2 36.07,15.24 36.07,22.86 34.29,24.64 | 5.59,8.38 5.59,3.05 RELAY1.- | C20.- 5.33,15.49 5.33,8.64 | R3.2 36.32,59.94 R4.2 36.32,54.86 37.59,53.59 37.59,51.05 R5.2 33.27,46.48 33.27,43.94 31.5,42.16 25.65,42.16 BLESHIELD.2 | S1.2 20.57,24.89 20.57,27.43 21.59,28.45 IC1.8 21.59,33.53 19.05,36.07 IC1.22 | C21.- 11.18,16.51 12.19,17.53 12.19,22.86 13.97,24.64 S1.1
  Bottom 0.203: C18.2 C19.2 45.21,13.97 45.21,18.8 IC2.2 | VCC.1 40.39,24.89 34.29,24.89 | C20.- 5.33,15.49 9.91,15.49 10.92,16.51 C21.- | BLESHIELD.2 23.11,37.85 20.57,37.85 19.05,36.32 IC1.22 | S1.1 14.22,24.89 20.32,24.89 S1.2 20.57,24.89 27.43,24.89
N$36
  Top 0.203: VCC.2 49.02,25.91 49.02,23.37 D1.A
N$37  (via drill 0.39)
  Top 0.203: v32.51,44.2 26.92,44.2 24.64,41.91 24.64,38.61 19.3,38.61 18.03,37.34 18.03,30.23 16.51,28.7 IC1.6
  Bottom 0.203: v32.51,44.2 40.89,52.58 46.48,52.58 LED3.1
N$38
  Top 0.203: RELAY1.+ 9.14,4.06 9.14,18.03 5.84,21.34 R8.2
N$42
  Bottom 0.203: 21.59,46.99 21.57,46.97
  pour Bottom: 0.13,0.13 0.13,72.39 51.56,72.39 51.56,0
RDYN  (via drill 0.39, 0.4)
  Top 0.254: U1.16 18.39,59.41 v19.18,60.2 | R2.1 4.24,49.44 v4.59,49.09 5.16,48.51 8.89,48.51 10.16,47.24 14.48,47.24 15.62,46.1 JP1.5
  Bottom 0.254: v19.18,60.2 12.19,60.2 9.4,57.4 9.4,54.61 4.59,49.8 v4.59,49.09
REL1  (via drill 0.39)
  Top 0.203: v40.89,28.19 40.89,11.18 35.56,5.84 35.56,3.05 25.91,3.05 RELAY1.O2
  Bottom 0.203: REL1.1 v40.89,28.19
REQN
  Top 0.254: U1.12 19.57,57.41 20.57,58.42 U3.4
REQN_5V  (via drill 0.39)
  Top 0.254: U3.5 23.88,57.78 24,57.66 24,56.01 24.89,55.12 v24.89,53.98
  Bottom 0.254: v24.89,53.98 24.89,51.18 21.84,48.13 20.19,48.13 19.3,47.24 14.35,47.24 JP1.4
RESET
  Top 0.254: U1.19 16.59,60.66 17.02,61.09 24.77,61.09 25.78,60.07 25.78,56.77 26.07,56.48 U3.10
RESET_5V  (via drill 0.39)
  Top 0.254: U3.9 27.43,55.51 v27.43,54.99
  Bottom 0.254: v27.43,54.99 27.43,52.07 21.34,45.97 JP1.7
SCK
  Top 0.254: U1.11 19.95,56.91 20.19,57.15 20.87,57.15 20.89,57.13 U3.6
SCK_5V  (via drill 0.39)
  Top 0.254: U3.7 22.9,56.48 v22.86,56.52
  Bottom 0.254: v22.86,56.52 24.13,55.24 24.13,51.31 21.46,48.64 19.94,48.64 19.05,47.75 13.84,47.75 13.46,47.37 9.78,47.37 9.27,46.86 9.27,45.47 8.51,44.7 6.73,44.7 JP1.1
VDD  (via drill 0.39, 0.4)
  Top 0.203: U1.9 18.63,55.91 | U1.1 14.09,54.16 12.67,52.74
  Top 0.254: U3.1 24.33,60.38 25.15,59.56 25.15,56.64 26.54,55.24 26.54,53.75 | JP1.8 23.24,46.74 25.27,48.77 25.27,50.55 25.94,51.21 U2.5 25.94,53.2 C17.1 | 12.67,52.74 12.52,52.58 11.3,52.58 10.25,51.52 | 18.63,55.91 18.63,55.89 C12.1 19.99,54.18 v20.95,53.21 | 10.25,51.52 C9.1 8.23,51.41 FB1.1 6.32,51.47 R2.2 6.14,49.76 v6.11,49.73 | 10.25,51.52 10.19,51.47
  Top 0.406: v20.95,53.21 21.46,53.21 21.84,52.83 25.57,52.83 C17.1 26.48,53.75 26.54,53.75
  Bottom 0.406: v6.11,49.73 7.63,49.73 11.54,53.63 15.47,53.63 17.75,55.91 18.9,55.91 20.95,53.85 v20.95,53.21
VIN
  Top 0.254: 25.94,48.13 | 25.94,48.13 U2.1 | 25.94,48.13 27.81,48.13 27.81,49.14 U2.3 29.28,49.17 C16.1
  Top 0.406: C16.1 29.54,47.19 JP1.10

### Text on the board
tPlace: nRF8001 | Bluetooth LE | SCK | MOSI | RDY | RST | GND | MISO | REQ | ACT | 3Vo | VIN
bPlace: VIN: 3.3-5V | LOGIC: 5V Safe